# EAGLE schematic wiring (EAGLE 9.2.0)
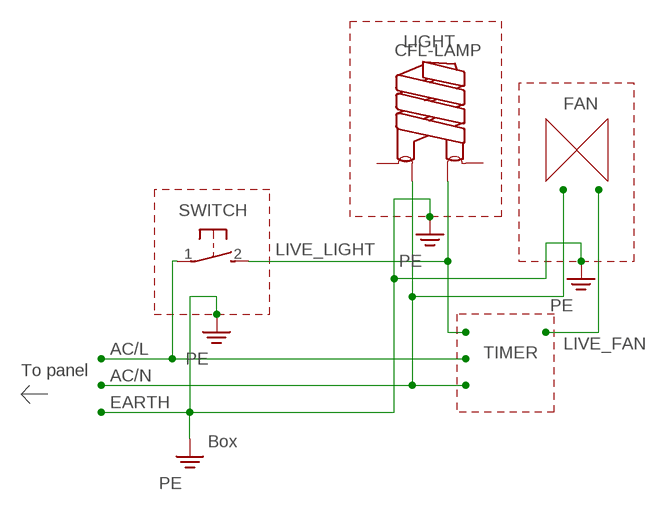
[diagram p0: schematic, sheet 1]

## Parts
LIGHT  CFL-LAMP  [CFL-LAMP]
SWITCH  31-XX  [B3F-31XX]

## Nets
AC/L: SWITCH.1(P)
AC/N: LIGHT.3
LIVE_LIGHT: LIGHT.4 SWITCH.2(S)
Unconnected: LIGHT.1 LIGHT.2

## Notes on the sheet
- FAN
- TIMER
- To panel
- Box

## Library data of the parts
LIGHT = ir:CFL-LAMP: fluorescent lamp; OC_FARNELL: unknown; OC_NEWARK: unknown
SWITCH = switch-omron:31-XX: OMRON SWITCH; MPN: B3F-3100; OC_FARNELL: 959704; OC_NEWARK: 36M3582